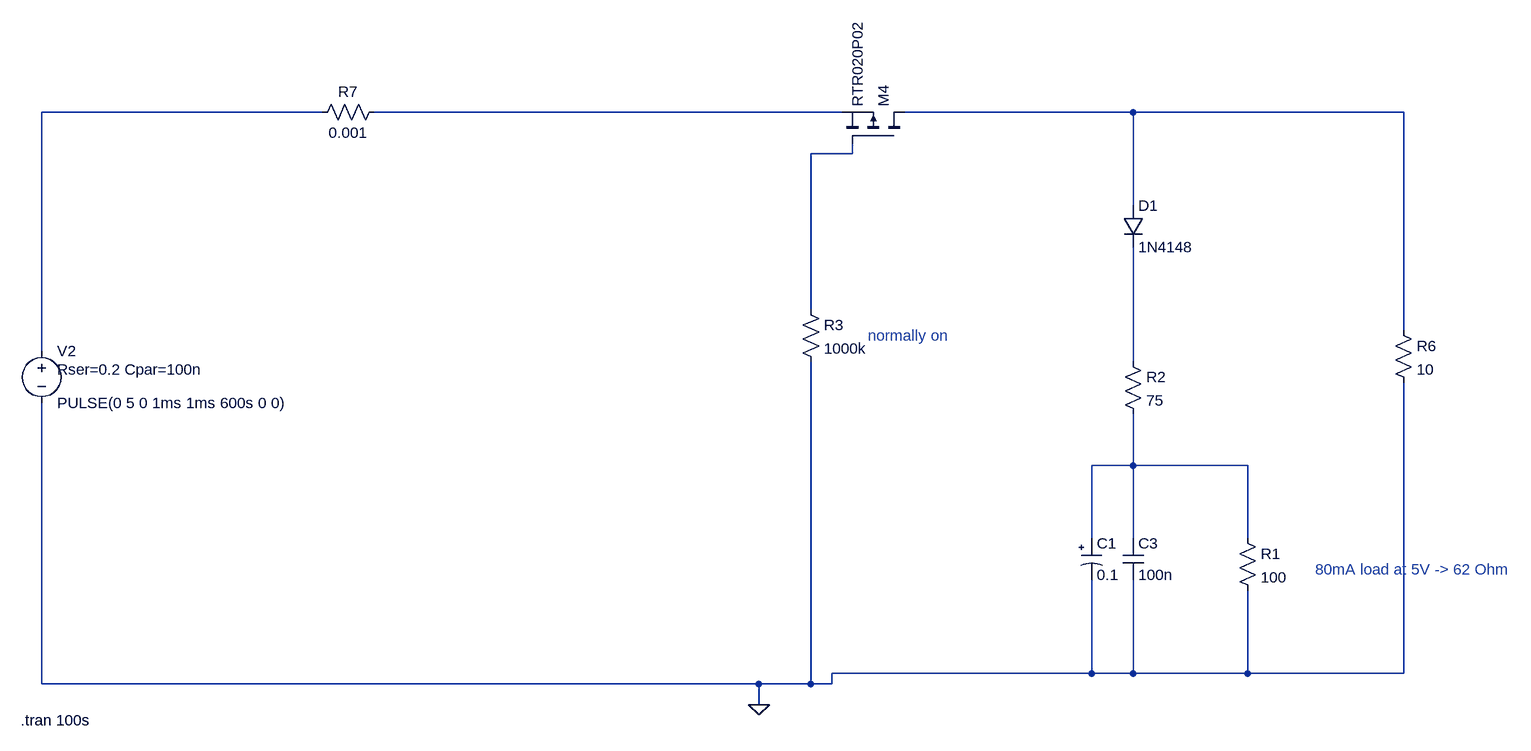
[diagram p0: schematic low_output_voltage.asc]
low_output_voltage.asc, the LTspice schematic file:
Version 4
SHEET 1 1864 680
WIRE -752 -480 -1184 -480
WIRE 48 -480 -672 -480
WIRE 496 -480 144 -480
WIRE 912 -480 496 -480
WIRE 64 -416 64 -432
WIRE 64 -416 0 -416
WIRE 496 -336 496 -480
WIRE 0 -176 0 -416
WIRE 912 -144 912 -480
WIRE -1184 -112 -1184 -480
WIRE 496 -96 496 -272
WIRE 496 64 496 -16
WIRE 496 64 432 64
WIRE 672 64 496 64
WIRE 432 176 432 64
WIRE 496 176 496 64
WIRE 672 176 672 64
WIRE 432 384 432 240
WIRE 432 384 32 384
WIRE 496 384 496 240
WIRE 496 384 432 384
WIRE 672 384 672 256
WIRE 672 384 496 384
WIRE 912 384 912 -64
WIRE 912 384 672 384
WIRE -1184 400 -1184 -32
WIRE -80 400 -1184 400
WIRE 0 400 0 -96
WIRE 0 400 -80 400
WIRE 32 400 32 384
WIRE 32 400 0 400
WIRE -80 432 -80 400
FLAG -80 432 0
SYMBOL voltage -1184 -128 R0
WINDOW 123 0 0 Left 0
WINDOW 39 24 44 Left 2
SYMATTR SpiceLine Rser=0.2 Cpar=100n
SYMATTR InstName V2
SYMATTR Value PULSE(0 5 0 1ms 1ms 600s 0 0)
SYMBOL res 656 160 R0
SYMATTR InstName R1
SYMATTR Value 100
SYMBOL cap 480 176 R0
SYMATTR InstName C3
SYMATTR Value 100n
SYMBOL pmos 144 -432 M270
SYMATTR InstName M4
SYMATTR Value RTR020P02
SYMBOL res -16 -192 R0
SYMATTR InstName R3
SYMATTR Value 1000k
SYMBOL polcap 416 176 R0
WINDOW 3 24 56 Left 2
SYMATTR Value 0.1
SYMATTR InstName C1
SYMATTR Description Capacitor
SYMATTR Type cap
SYMATTR SpiceLine V=5.5 Irms=2.86 Rser=75 Lser=0
SYMBOL res 480 -112 R0
SYMATTR InstName R2
SYMATTR Value 75
SYMBOL diode 480 -336 R0
SYMATTR InstName D1
SYMATTR Value 1N4148
SYMBOL res 896 -160 R0
SYMATTR InstName R6
SYMATTR Value 10
SYMBOL res -656 -496 R90
WINDOW 0 0 56 VBottom 2
WINDOW 3 32 56 VTop 2
SYMATTR InstName R7
SYMATTR Value 0.001
TEXT -1216 456 Left 2 !.tran 100s
TEXT 776 224 Left 2 ;80mA load at 5V -> 62 Ohm
TEXT 88 -136 Left 2 ;normally on

The netlist it stands for:
* low_output_voltage.asc
V2 N001 0 PULSE(0 5 0 1ms 1ms 600s 0 0) Rser=0.2 Cpar=100n
R1 N006 0 100
C3 N006 0 100n
M4 N003 N004 N002 N002 RTR020P02
R3 N004 0 1000k
C1 N006 0 0.1 V=5.5 Irms=2.86 Rser=75 Lser=0
R2 N005 N006 75
D1 N003 N005 1N4148
R6 N003 0 10
R7 N002 N001 0.001
.model D D
.lib standard.dio
.model NMOS NMOS
.model PMOS PMOS
.lib standard.mos
.tran 100s
* 80mA load at 5V -> 62 Ohm
* normally on
.backanno
.end